# EAGLE design assignment1 (EAGLE 9.6.2)
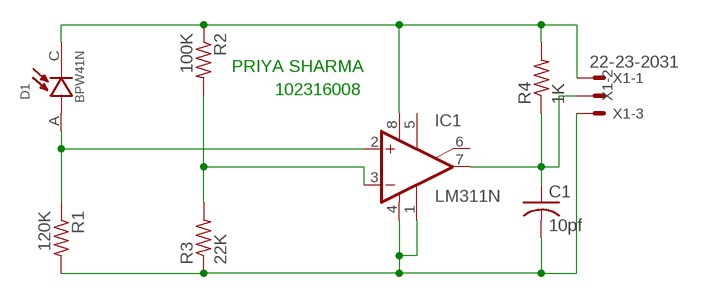
[diagram p0: schematic, sheet 1]

## Parts
C1  10pf  C-US025-024X044  [C025-024X044]
D1  BPW41N  [DIO_BPW41N]
IC1  LM311N  [DIL08]
R1  120K  R-US_0204/5  [0204/5]
R2  100K  R-US_0204/5  [0204/5]
R3  22K  R-US_0204/5  [0204/5]
R4  1K  R-US_0204/5  [0204/5]
X1  22-23-2031  [22-23-2031]

## Nets
N$1: D1.A IC1.2(+IN) R1.1
N$2: C1.2 IC1.1(GND) IC1.4(V-) R1.2 R3.1 X1.3
N$3: IC1.3(-IN) R2.2 R3.2
N$4: D1.C IC1.8(V+) R2.1 R4.2 X1.1
N$5: C1.1 IC1.7(OUT) R4.1 X1.2
Unconnected: IC1.5(ON) IC1.6(ON/STR)

## Notes on the sheet
- PRIYA SHARMA
- 102316008

## Library data of the parts
C1 = rcl:C-US: CAPACITOR, American symbol; SPICEPREFIX: C
D1 = BPW41N:BPW41N: BPW41N Series 65° Side View 950 nm PIN Photodiode Check availability <https://pricing.snapeda.com/parts/BPW41N/Vishay%20Semiconductor%20Opto%20Division/view-part?ref=eda>; AVAILABILITY: In Stock; DESCRIPTION: Photodiode 940nm 130° Radial, Side View; MF: Vishay Semiconductor Opto Division; MP: BPW41N; PACKAGE: None; PRICE: None; PURCHASE-URL: https://pricing.snapeda.com/search/part/BPW41N/?ref=eda
IC1 = linear:LM311: COMPARATOR
R1-R4 = rcl:R-US_: RESISTOR, American symbol; SPICEPREFIX: R
X1 = con-molex:22-23-2031: .100" (2.54mm) Center Header - 3 Pin; MF: MOLEX; MPN: 22-23-2031; OC_FARNELL: 1462950; OC_NEWARK: 30C0862

## Board
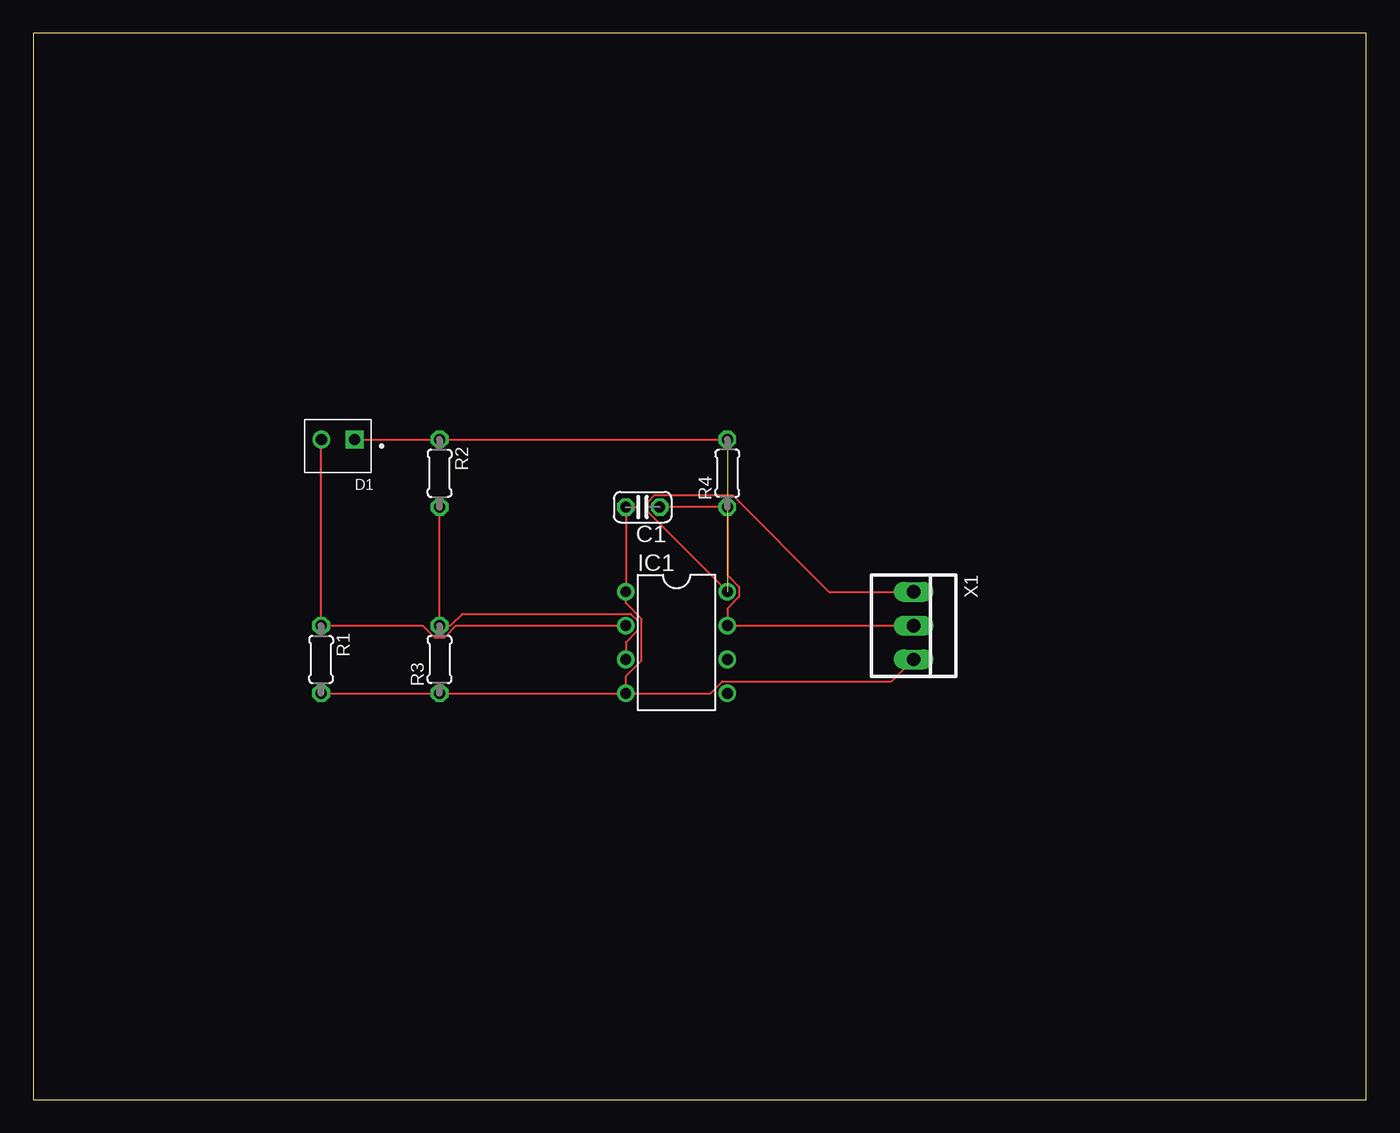
[diagram p1: board, top side]

Size 100 x 80 mm. Coordinates in mm from the lower left corner, seen from the top.
Outline: 0,0 100,0 100,80 0,80 0,0
Copper layers (1*16): Top 0.035mm / dielectric 1.5mm / Bottom 0.035mm
Design rules "default": minimum track width 6mil, minimum drill 0.35mm, track to track 6mil, track to pad 6mil, pad to pad 6mil, via to via 6mil, smd to smd 6mil, copper to edge 40mil, drill to drill 6mil, minimum pad ring 10mil, minimum via ring 8mil, stop-mask expansion 4mil, vias tented up to drill 0mil, thermal gap 10mil

### Footprints (pad centres in the part's own frame; a part is rotated, then mirrored left to right if it is on the bottom)
C025-024X044 = drill 0.813 octagon: 1 -1.27,0; 2 1.27,0
DIO_BPW41N = drill 0.83 pad 1.25: A 1.25,0 | drill 0.83 pad 1.25 square: C -1.25,0
DIL08 = drill 0.813 pad 1.27: 1 -3.81,-3.81; 2 -1.27,-3.81; 3 1.27,-3.81; 4 3.81,-3.81; 5 3.81,3.81; 6 1.27,3.81; 7 -1.27,3.81; 8 -3.81,3.81
0204/5 = drill 0.813 octagon: 1 -2.54,0; 2 2.54,0
22-23-2031 = drill 1 long: 1 -2.54,0; 2 0,0; 3 2.54,0

### Placement (x,y rotation side)
C1  45.72,44.45 180 top
D1  22.86,49.53 180 top
IC1  48.26,34.29 270 top
R1  21.59,33.02 270 top
R2  30.48,46.99 270 top
R3  30.48,33.02 90 top
R4  52.07,46.99 90 top
X1  66.04,35.56 270 top

### Tracks (layer width: path | path; a pad name or v marks a point on that pad's centre or on a via)
N$1
  Top 0.152: D1.A 21.59,49.51 R1.1 29.22,35.56 30.11,34.67 30.85,34.67 31.74,35.56 IC1.2
N$2
  Top 0.152: R1.2 R3.1 IC1.4 | C1.2 IC1.1 44.45,37.25 45.64,36.05 45.64,32.96 44.45,31.76 IC1.4 | IC1.4 50.81,30.48 51.7,31.37 64.39,31.37 X1.3
N$3
  Top 0.152: R2.2 R3.2 31.31,35.56 32.2,36.45 44.82,36.45 45.34,35.93 45.34,35.19 44.45,34.3 IC1.3
N$4  (1 unrouted)
  Top 0.152: D1.C R2.1 R4.2 | X1.1 59.68,38.1 52.44,45.34 46.62,45.34 46.1,44.82 46.1,44.08 52.07,38.11 IC1.8
N$5
  Top 0.152: C1.1 R4.1 52.07,39.36 52.96,38.47 52.96,37.73 52.07,36.84 IC1.7 X1.2